# EAGLE schematic WheelController1_0 (EAGLE 6.4)
Wheel Controller 1_1 Schematic - Travis Thatcher 2014
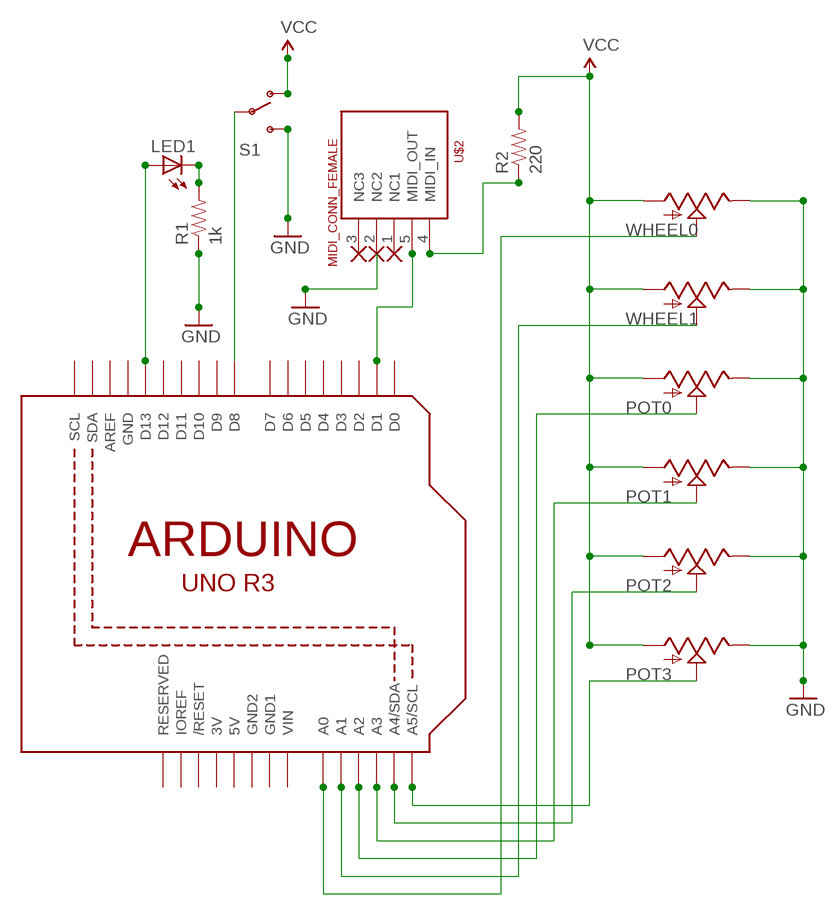
[diagram p0: schematic, sheet 1]

## Parts
LED1  LED5MM  [LED5MM]
POT0  POTMAM  [POT_MAMMOTH]
POT1  POTMAM  [POT_MAMMOTH]
POT2  POTMAM  [POT_MAMMOTH]
POT3  POTMAM  [POT_MAMMOTH]
R1  1k  RESISTORKIT  [AXIAL-0.3-KIT]
R2  220  RESISTORKIT  [AXIAL-0.3-KIT]
S1  SWITCH-SPSTPTH  [SWITCH-SPDT]
U1  ARDUINOR3-DIMENSION  [ARDUINOR3]
U$2  MIDI_CONN_FEMALE  [DIN_5_FEMALE]
WHEEL0  POTMAM  [POT_MAMMOTH]
WHEEL1  POTMAM  [POT_MAMMOTH]

## Nets
GND: POT0.P$3(E) POT1.P$3(E) POT2.P$3(E) POT3.P$3(E) R1.P$1 S1.3(S) U$2.2(NC2) WHEEL0.P$3(E) WHEEL1.P$3(E)
N$1: S1.2(P) U1.D8
N$2: LED1.K(C) R1.P$2
N$3: LED1.A U1.D13
N$4: U1.A0 WHEEL0.P$1(S)
N$5: U1.A1 WHEEL1.P$1(S)
N$6: POT0.P$1(S) U1.A2
N$7: POT1.P$1(S) U1.A3
N$8: POT2.P$1(S) U1.A4(A4/SDA)
N$9: POT3.P$1(S) U1.A5(A5/SCL)
N$10: U1.D1 U$2.5(MIDI_OUT)
N$12: R2.P$1 U$2.4(MIDI_IN)
VCC: POT0.P$2(A) POT1.P$2(A) POT2.P$2(A) POT3.P$2(A) R2.P$2 S1.1(O) WHEEL0.P$2(A) WHEEL1.P$2(A)
Unconnected: U1.AREF U1.D0 U1.D2 U1.D3 U1.D4 U1.D5 U1.D6 U1.D7 U1.D9 U1.D10 U1.D11 U1.D12 U1.IOREF U1.RESERVED U1.RESET(/RESET) U1.SCL U1.SDA U$2.1(NC1) U$2.3(NC3)

## Power pins joined to a net without a drawn wire
3V: U1.3V
5V: U1.5V
GND: U1.GND
GND1: U1.GND1
GND2: U1.GND2
VIN: U1.VIN

## Library data of the parts
LED1 = SparkFun:LED: LEDs Standard schematic elements and footprints for 5mm, 3mm, 1206, and 0603 sized LEDs. 5mm - Spark Fun Electronics SKU : COM-00529 (and others)
POT0 POT1-POT3 WHEEL0 WHEEL1 = SparkFun:POT
R1 R2 = SparkFun:RESISTOR: Resistor Basic schematic elements and footprints for 0603, 1206, and PTH resistors.
S1 = SparkFun:SWITCH-SPST: SPST Switch Simple slide switch. Spark Fun Electronics SKU : COM-00102
U1 = adafruit:ARDUINOR3: This is a new object for the new Arduino R3 - with extra pins that you may want to use (such as IOref, and duplicated A4/A5
U$2 = SparkFun:MIDI_CONN_FEMALE